# EasyEDA schematic SCH_Teensy-PWM-Machine_2025-12-06 (1).json
TITLE: Sheet_1; REV: 1.0; Date: 2025-12-06; Sheet: 1/1; Drawn By: rayjorgensen; Company: Your Company
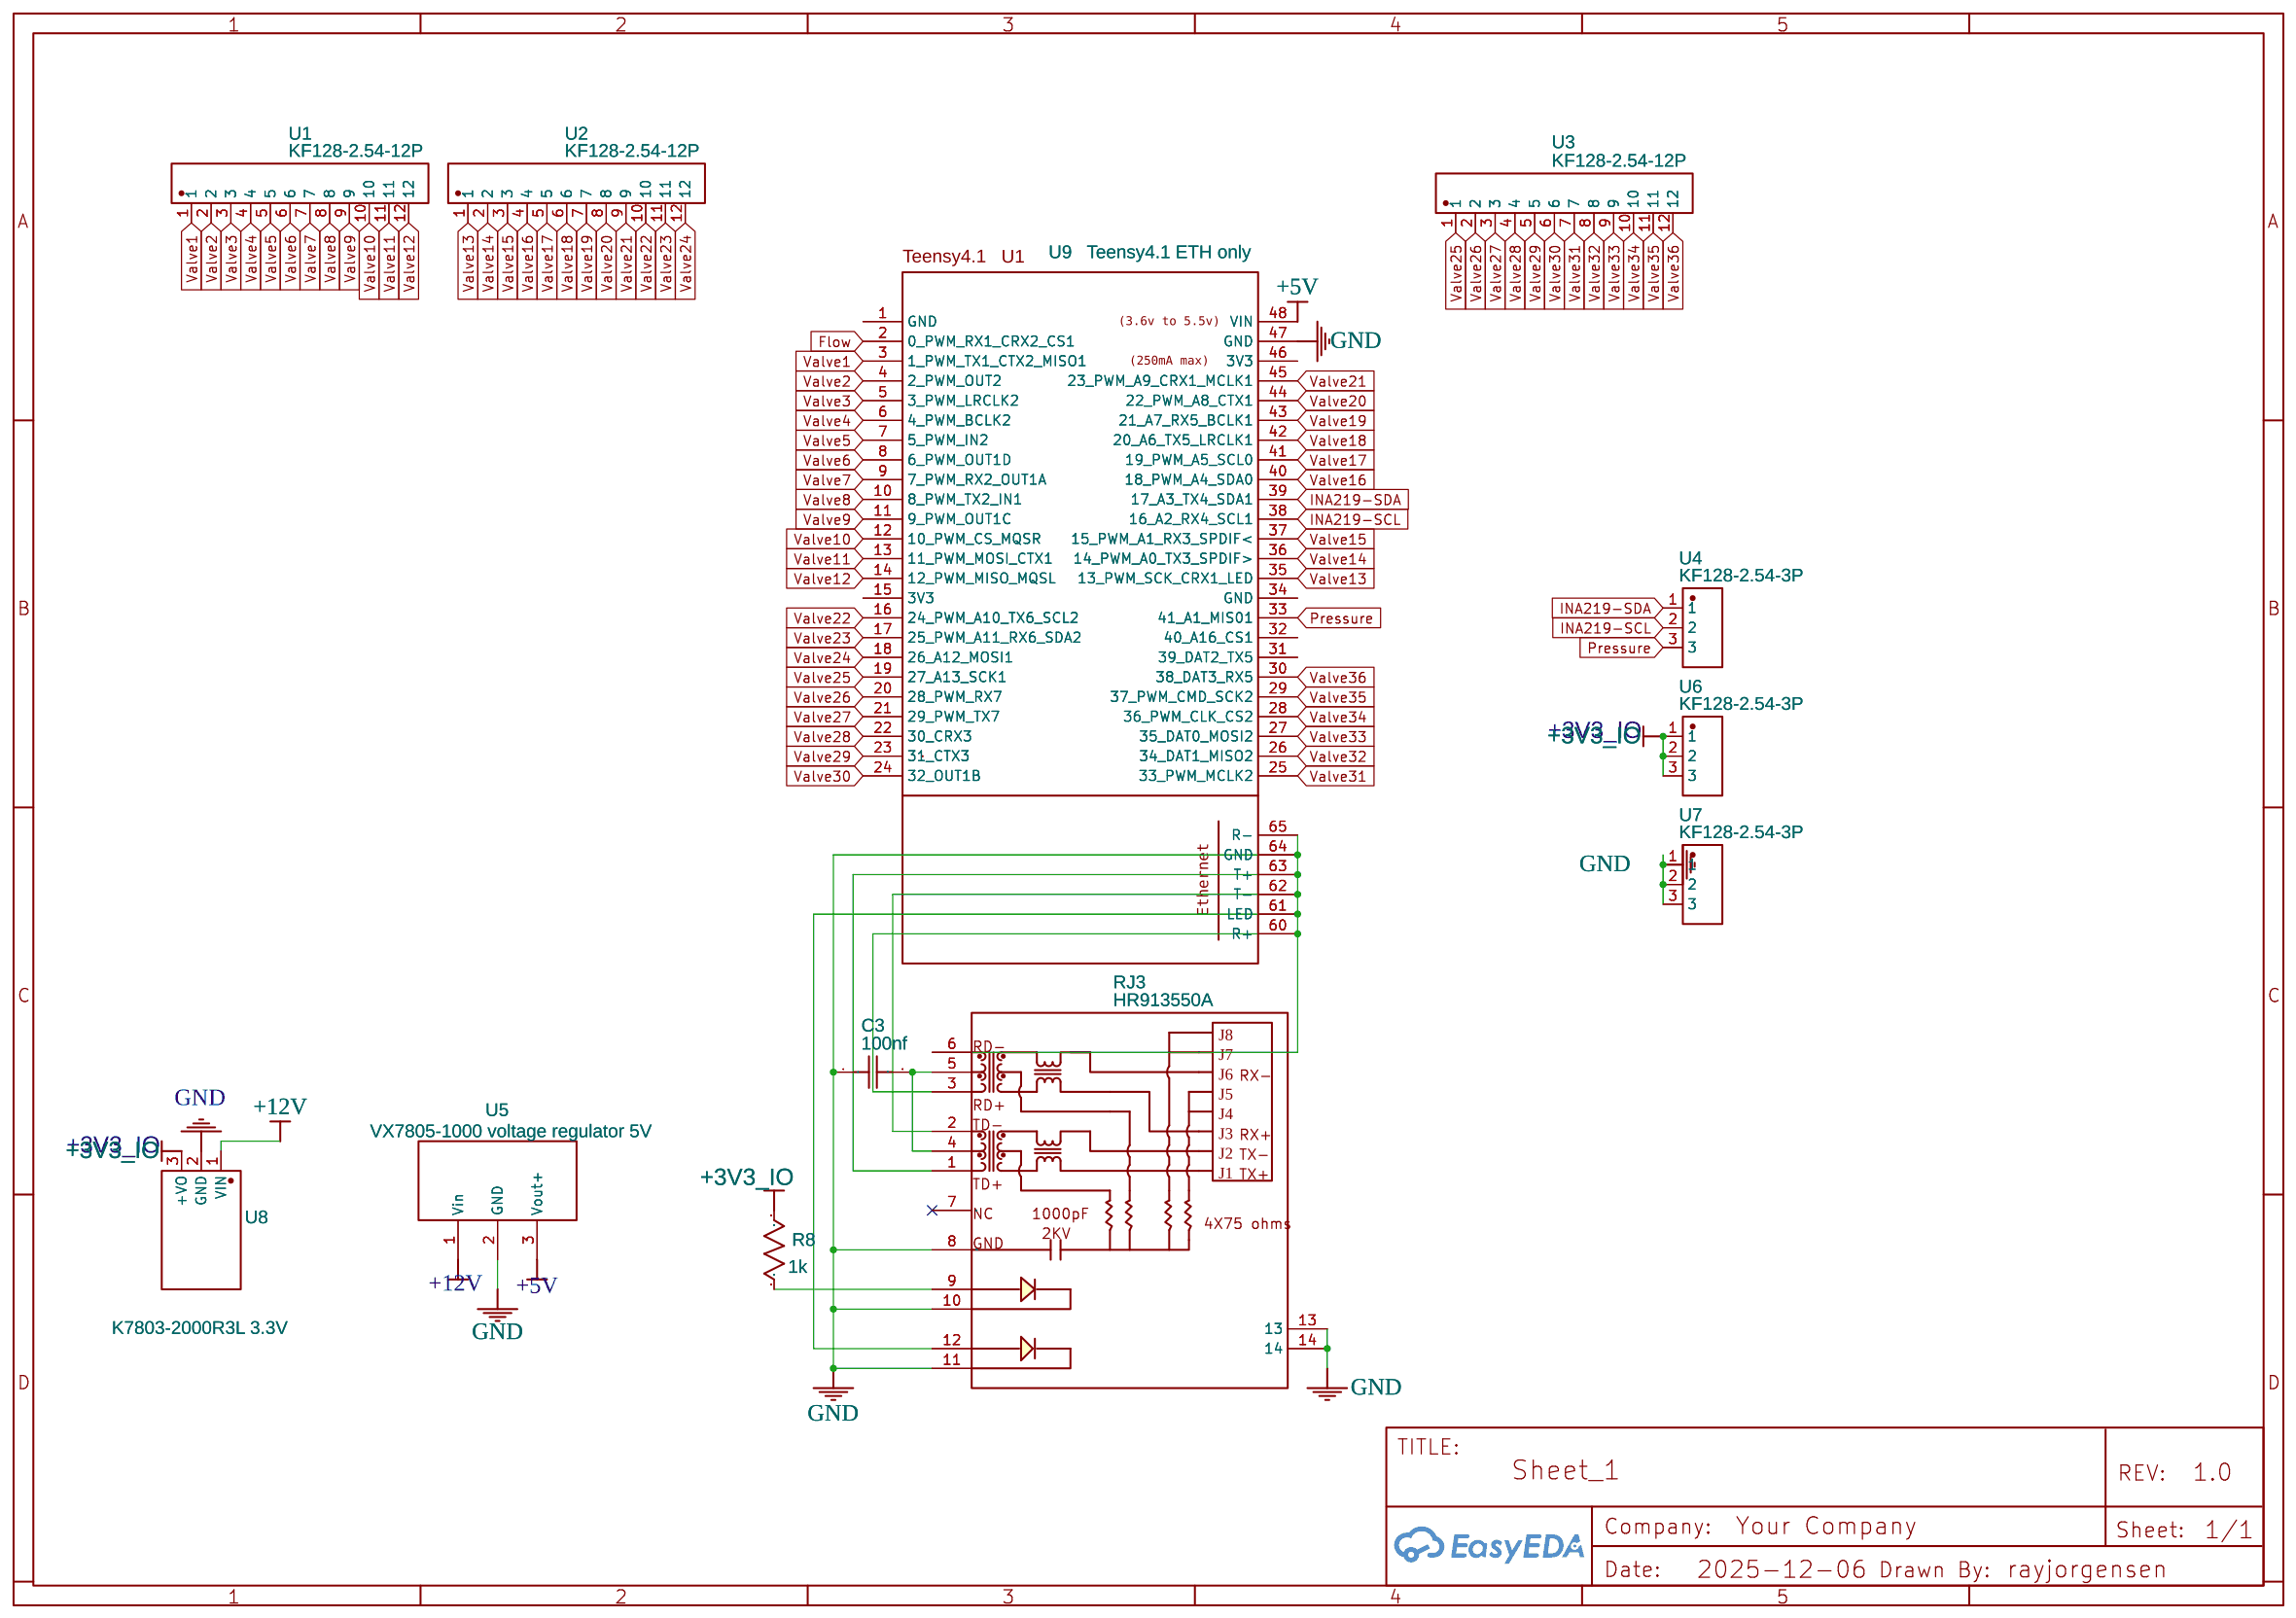
[diagram p0: schematic sheet]

## Parts
C3  100nf  [RAD-0.1]
R8  1k  [R_AXIAL-0.4]
RJ3  HR913550A  [RJ45-TH_HR913550A]
U1  KF128-2.54-12P  [CONN-TH_12P-P2.54_KF128-2.54-12P]
U2  KF128-2.54-12P  [CONN-TH_12P-P2.54_KF128-2.54-12P]
U3  KF128-2.54-12P  [CONN-TH_12P-P2.54_KF128-2.54-12P]
U4  KF128-2.54-3P  [CONN-TH_3P-P2.54_KF128-2.54-3P]
U5  VX7805-1000 voltage regulator 5V  [VX7805-1000]
U6  KF128-2.54-3P  [CONN-TH_3P-P2.54_KF128-2.54-3P]
U7  KF128-2.54-3P  [CONN-TH_3P-P2.54_KF128-2.54-3P]
U8  K7803-2000R3L 3.3V  [PWRM-TH_K78XX-2000]
U9  Teensy4.1 ETH only  [TEENSY4.1 ETH ONLY]

## Library data of the parts
C3 = C_RAD-0.1_US: Contributor: LCEDA_Lib
R8 = R_AXIAL-0.4_US: Contributor: LCEDA_Lib
RJ3 = HR913550A: Supplier: LCSC; Manufacturer: HANRUN; Contributor: LCSC; Supplier Part: C163507
U1-U3 = KF128-2.54-12P: Contributor: LCSC; Supplier: LCSC; Supplier Part: C474929; Manufacturer: KEFA(科发); JLCPCB Part Class: Extended Part
U4 U6 U7 = KF128-2.54-3P: Contributor: LCSC; Supplier: LCSC; Supplier Part: C474921; Manufacturer: KEFA(科发); JLCPCB Part Class: Extended Part
U5 = VX7805-1000 voltage regulator: Manufacturer: CUI; Supplier: Digi-Key; Supplier Part: 102-4253-ND; Contributor: j.eilers02; link: https://www.digikey.ca/products/en?keywords=102-4253-ND
U8 = K7803-2000R3L: Supplier: LCSC; Supplier Part: C189565; Manufacturer: MORNSUN Guangzhou S& T; Manufacturer Part: K7803-2000; Contributor: LCSC; JLCPCB Part Class: Extended Part
U9 = Teensy4.1 ETH only: Manufacturer: PJRC; Manufacturer Part: Teensy4.1; link: https://www.pjrc.com/store/teensy41.html; Contributor: Synchrotron

## Nets
+3V3_IO: R8.2 U6.1 U6.2 U6.3 U8.3(+VO)
+5V: U5.3(Vout+) U9.48(VIN)
+12V: U5.1(Vin) U8.1(VIN)
GND: C3.1 RJ3.1 RJ3.2 RJ3.3 RJ3.6 RJ3.8(GND) RJ3.10 RJ3.11 RJ3.12 RJ3.13 RJ3.14 U5.2(GND) U7.1 U7.2 U7.3 U8.2(GND) U9.47(GND) U9.60(R+) U9.61(LED) U9.62(T-) U9.63(T+) U9.64(GND) U9.65(R-)
Flow: U9.2(0_PWM_RX1_CRX2_CS1)
INA219-SCL: U4.2 U9.38(16_A2_RX4_SCL1)
INA219-SDA: U4.1 U9.39(17_A3_TX4_SDA1)
Pressure: U4.3 U9.33(41_A1_MIS01)
Valve1: U1.1 U9.3(1_PWM_TX1_CTX2_MISO1)
Valve2: U1.2 U9.4(2_PWM_OUT2)
Valve3: U1.3 U9.5(3_PWM_LRCLK2)
Valve4: U1.4 U9.6(4_PWM_BCLK2)
Valve5: U1.5 U9.7(5_PWM_IN2)
Valve6: U1.6 U9.8(6_PWM_OUT1D)
Valve7: U1.7 U9.9(7_PWM_RX2_OUT1A)
Valve8: U1.8 U9.10(8_PWM_TX2_IN1)
Valve9: U1.9 U9.11(9_PWM_OUT1C)
Valve10: U1.10 U9.12(10_PWM_CS_MQSR)
Valve11: U1.11 U9.13(11_PWM_MOSI_CTX1)
Valve12: U1.12 U9.14(12_PWM_MISO_MQSL)
Valve13: U2.1 U9.35(13_PWM_SCK_CRX1_LED)
Valve14: U2.2 U9.36(14_PWM_A0_TX3_SPDIF>)
Valve15: U2.3 U9.37(15_PWM_A1_RX3_SPDIF<)
Valve16: U2.4 U9.40(18_PWM_A4_SDA0)
Valve17: U2.5 U9.41(19_PWM_A5_SCL0)
Valve18: U2.6 U9.42(20_A6_TX5_LRCLK1)
Valve19: U2.7 U9.43(21_A7_RX5_BCLK1)
Valve20: U2.8 U9.44(22_PWM_A8_CTX1)
Valve21: U2.9 U9.45(23_PWM_A9_CRX1_MCLK1)
Valve22: U2.10 U9.16(24_PWM_A10_TX6_SCL2)
Valve23: U2.11 U9.17(25_PWM_A11_RX6_SDA2)
Valve24: U2.12 U9.18(26_A12_MOSI1)
Valve25: U3.1 U9.19(27_A13_SCK1)
Valve26: U3.2 U9.20(28_PWM_RX7)
Valve27: U3.3 U9.21(29_PWM_TX7)
Valve28: U3.4 U9.22(30_CRX3)
Valve29: U3.5 U9.23(31_CTX3)
Valve30: U3.6 U9.24(32_OUT1B)
Valve31: U3.7 U9.25(33_PWM_MCLK2)
Valve32: U3.8 U9.26(34_DAT1_MISO2)
Valve33: U3.9 U9.27(35_DAT0_MOSI2)
Valve34: U3.10 U9.28(36_PWM_CLK_CS2)
Valve35: U3.11 U9.29(37_PWM_CMD_SCK2)
Valve36: U3.12 U9.30(38_DAT3_RX5)
Net-(C3-2): C3.2 RJ3.4 RJ3.5
Net-(R8-1): R8.1 RJ3.9

Not connected (* = marked no-connect by the designer): RJ3 7(NC)*; U9 1(GND) 15(3V3) 31(39_DAT2_TX5) 32(40_A16_CS1) 34(GND) 46(3V3)

## Notes on the sheet
- +3V3_IO
- +3V3_IO
